# EAGLE design 4x2AND_OR_1 (EAGLE 6.5.0)

## Sheet 1 of 4
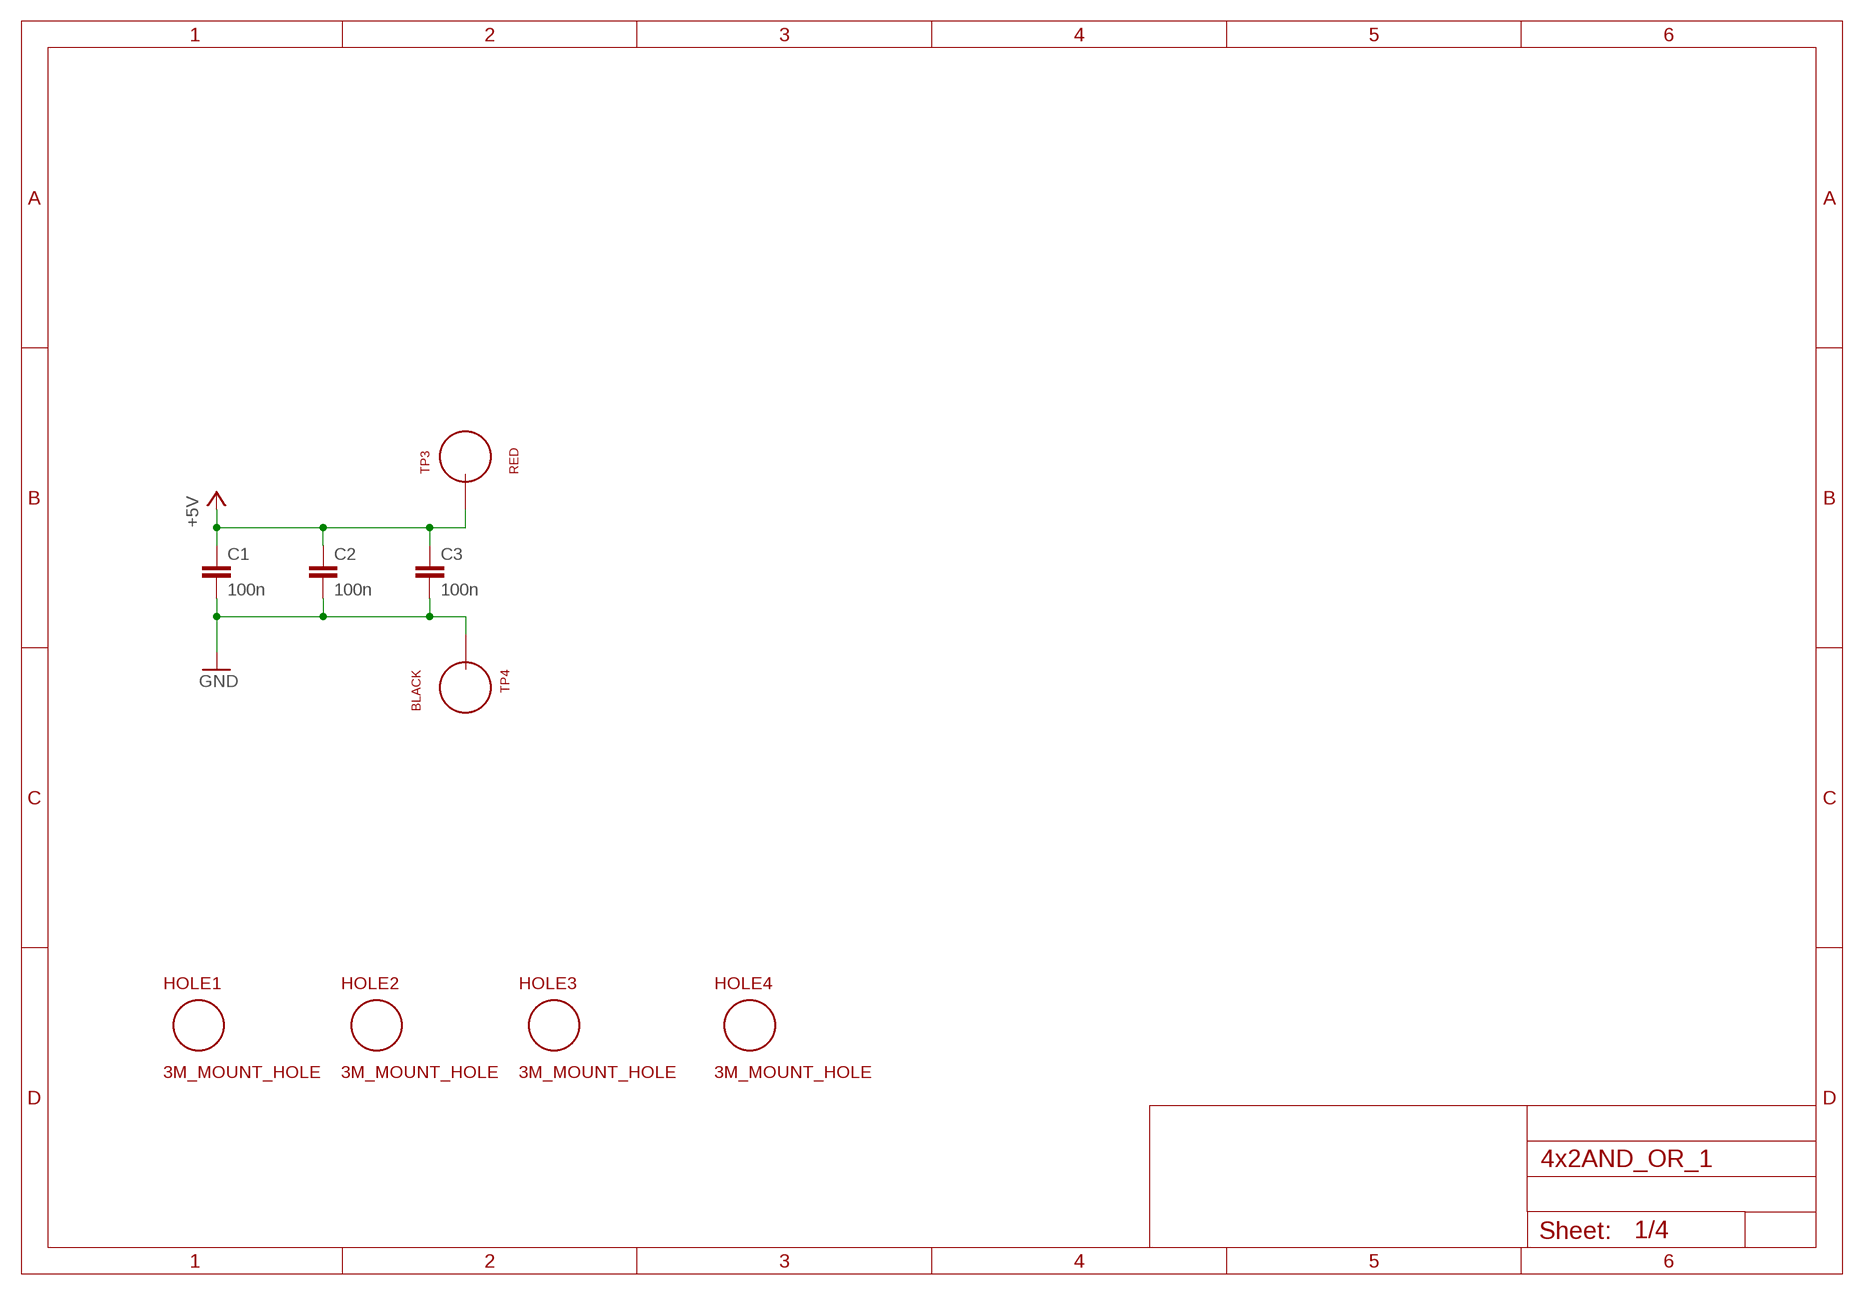
[diagram p0: schematic, sheet 1]

### Parts
C1  100n  C_P2INCH  [CAP_P2INCH]
C2  100n  C_P2INCH  [CAP_P2INCH]
C3  100n  C_P2INCH  [CAP_P2INCH]
HOLE1  3M_MOUNT_HOLE  [3M_HOLE]
HOLE2  3M_MOUNT_HOLE  [3M_HOLE]
HOLE3  3M_MOUNT_HOLE  [3M_HOLE]
HOLE4  3M_MOUNT_HOLE  [3M_HOLE]
TP3  RED  TEST_LOOP  [TEST_LOOP]
TP4  BLACK  TEST_LOOP  [TEST_LOOP]

### Nets
+5V: C1.1 C2.1 C3.1 TP3.P$1 ; also sheet 2,3,4
GND: C1.2 C2.2 C3.2 TP4.P$1 ; also sheet 2,3,4

## Sheet 2 of 4
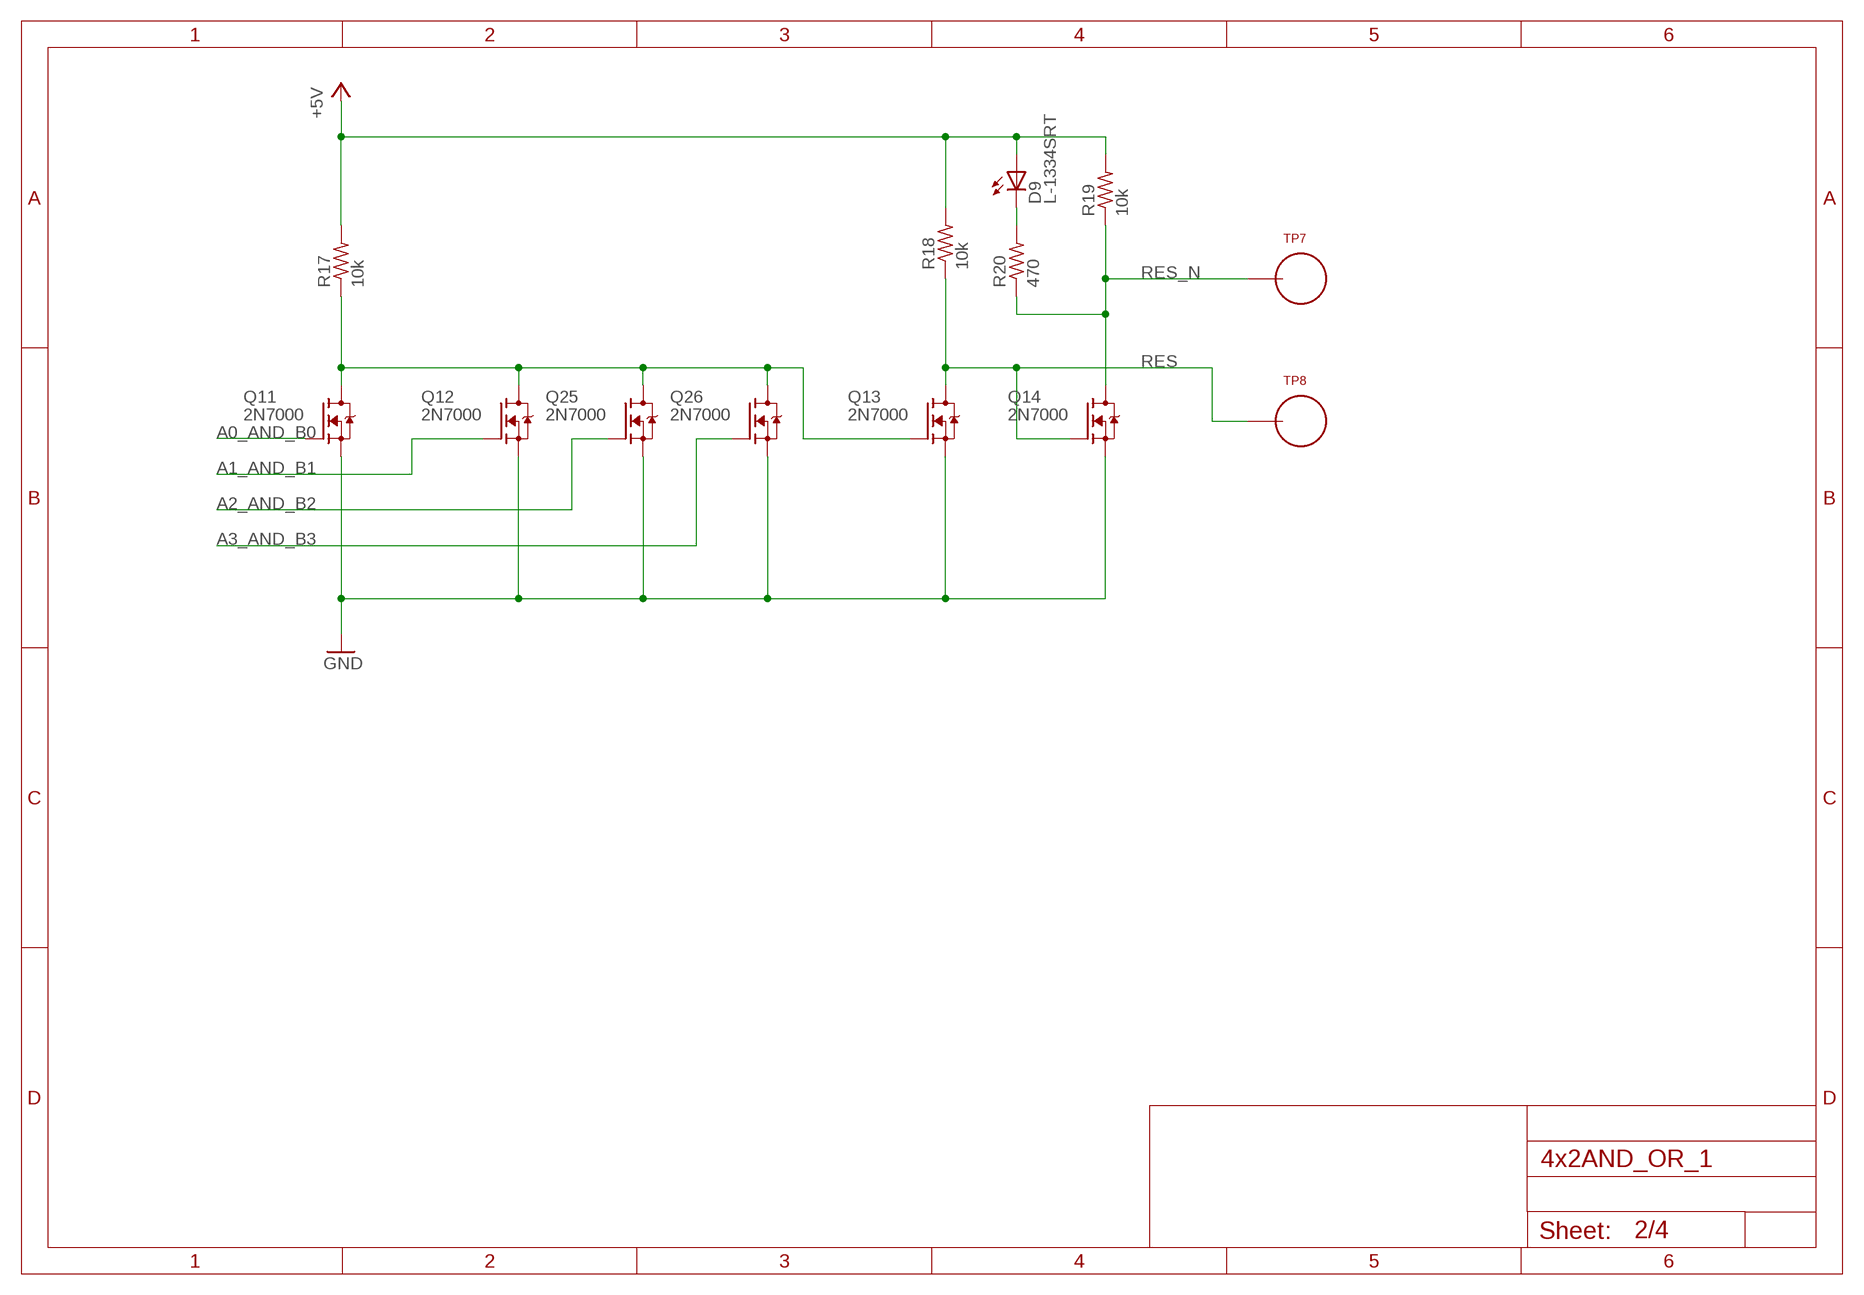
[diagram p1: schematic, sheet 2]

### Parts
D9  L-1334SRT  [LED3MM]
Q11  2N7000  [TO92-DGS]
Q12  2N7000  [TO92-DGS]
Q13  2N7000  [TO92-DGS]
Q14  2N7000  [TO92-DGS]
Q25  2N7000  [TO92-DGS]
Q26  2N7000  [TO92-DGS]
R17  10k  R_P2INCH  [R_P2INCH]
R18  10k  R_P2INCH  [R_P2INCH]
R19  10k  R_P2INCH  [R_P2INCH]
R20  470  R_P2INCH  [R_P2INCH]
TP7  TEST_LOOP  [TEST_LOOP]
TP8  TEST_LOOP  [TEST_LOOP]

### Nets
+5V: D9.A R17.2 R18.2 R19.2 ; also sheet 1,3,4
A0_AND_B0: Q11.G ; also sheet 3
A1_AND_B1: Q12.G ; also sheet 3
A2_AND_B2: Q25.G ; also sheet 4
A3_AND_B3: Q26.G ; also sheet 4
GND: Q11.S Q12.S Q13.S Q14.S Q25.S Q26.S ; also sheet 1,3,4
N$13: Q11.D Q12.D Q13.G Q25.D Q26.D R17.1
N$19: D9.K(C) R20.2
RES: Q13.D Q14.G R18.1 TP8.P$1
RES_N: Q14.D R19.1 R20.1 TP7.P$1

## Sheet 3 of 4
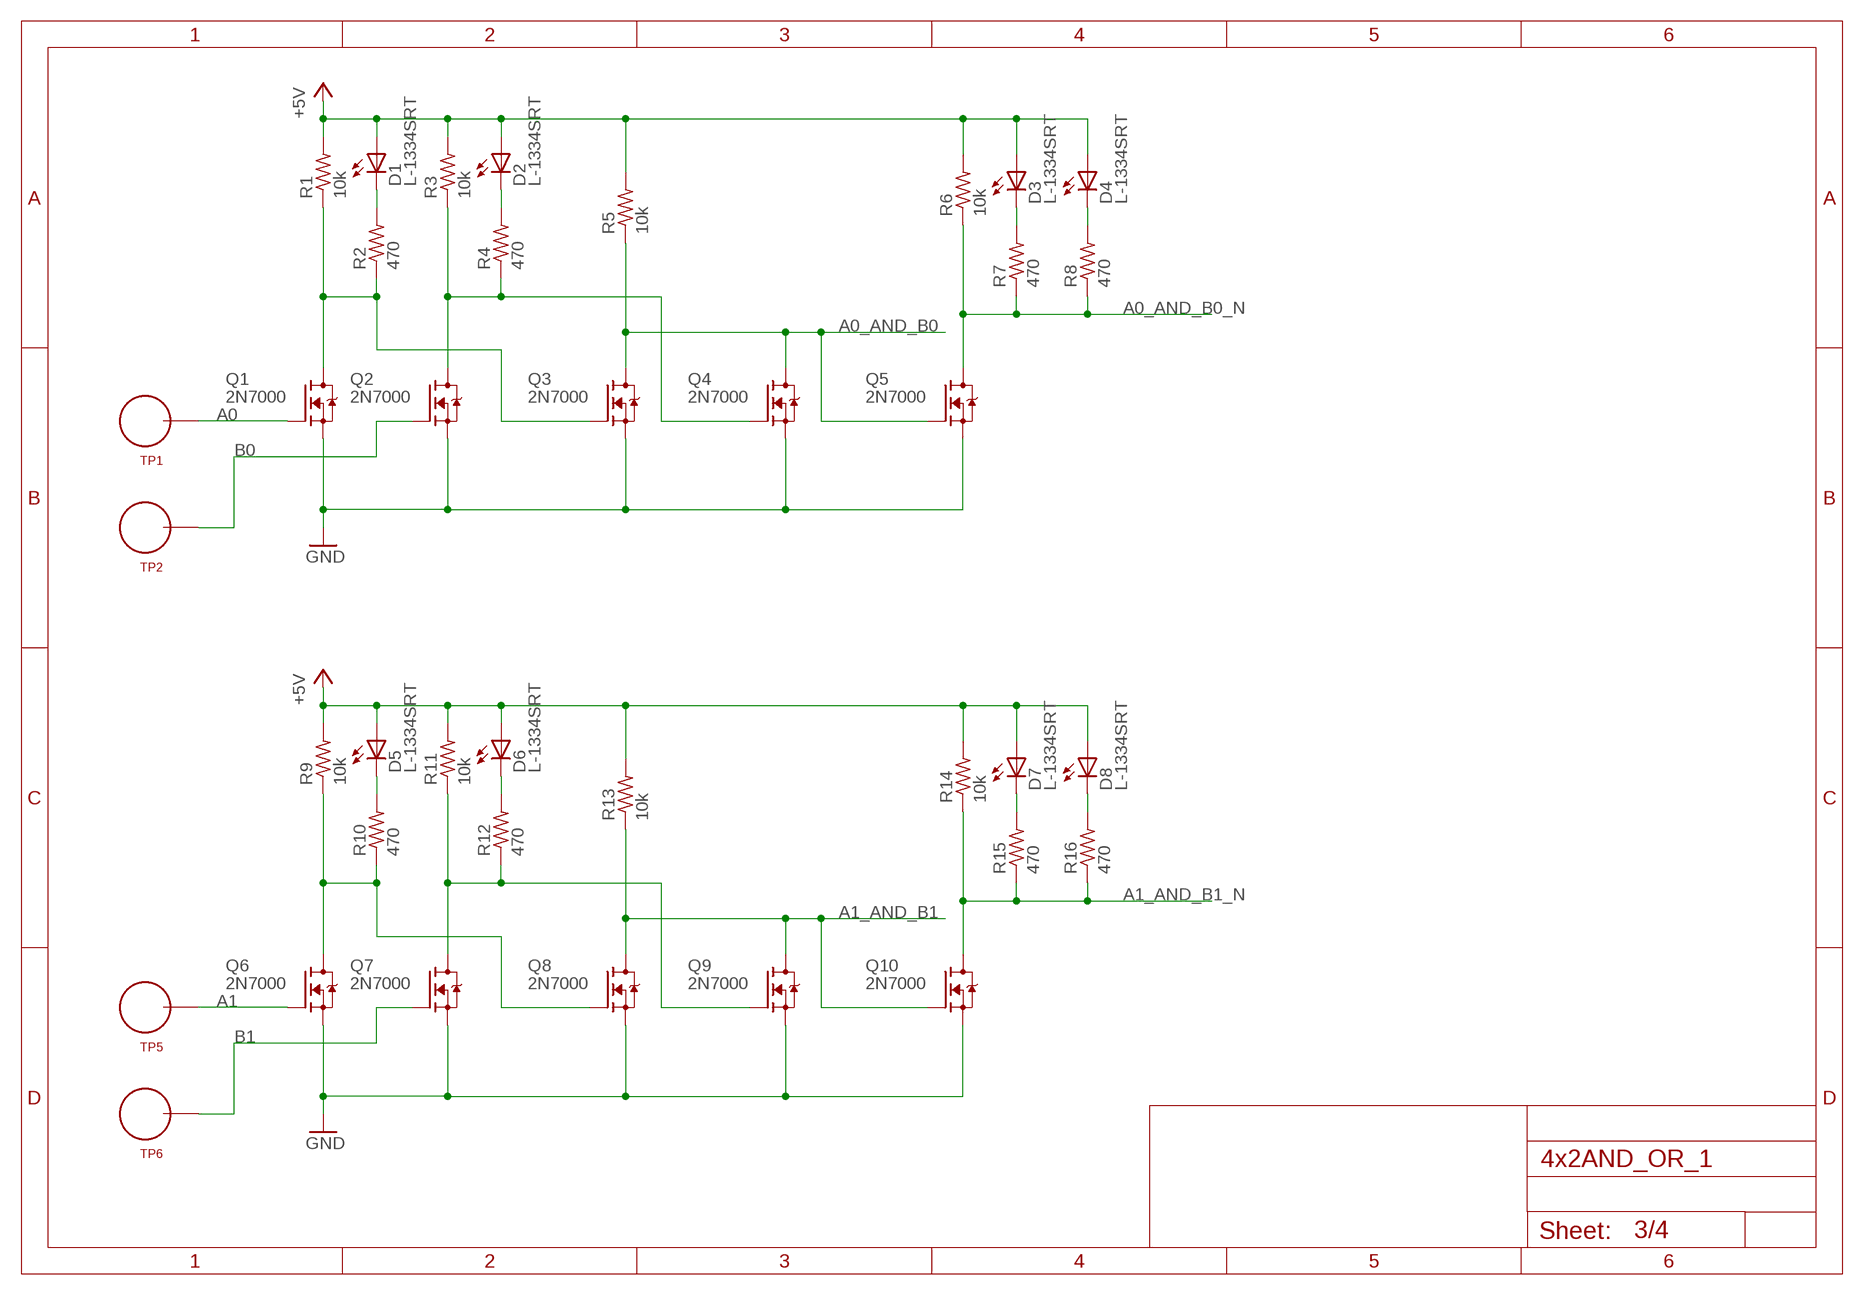
[diagram p2: schematic, sheet 3]

### Parts
D1  L-1334SRT  [LED3MM]
D2  L-1334SRT  [LED3MM]
D3  L-1334SRT  [LED3MM]
D4  L-1334SRT  [LED3MM]
D5  L-1334SRT  [LED3MM]
D6  L-1334SRT  [LED3MM]
D7  L-1334SRT  [LED3MM]
D8  L-1334SRT  [LED3MM]
Q1  2N7000  [TO92-DGS]
Q2  2N7000  [TO92-DGS]
Q3  2N7000  [TO92-DGS]
Q4  2N7000  [TO92-DGS]
Q5  2N7000  [TO92-DGS]
Q6  2N7000  [TO92-DGS]
Q7  2N7000  [TO92-DGS]
Q8  2N7000  [TO92-DGS]
Q9  2N7000  [TO92-DGS]
Q10  2N7000  [TO92-DGS]
R1  10k  R_P2INCH  [R_P2INCH]
R2  470  R_P2INCH  [R_P2INCH]
R3  10k  R_P2INCH  [R_P2INCH]
R4  470  R_P2INCH  [R_P2INCH]
R5  10k  R_P2INCH  [R_P2INCH]
R6  10k  R_P2INCH  [R_P2INCH]
R7  470  R_P2INCH  [R_P2INCH]
R8  470  R_P2INCH  [R_P2INCH]
R9  10k  R_P2INCH  [R_P2INCH]
R10  470  R_P2INCH  [R_P2INCH]
R11  10k  R_P2INCH  [R_P2INCH]
R12  470  R_P2INCH  [R_P2INCH]
R13  10k  R_P2INCH  [R_P2INCH]
R14  10k  R_P2INCH  [R_P2INCH]
R15  470  R_P2INCH  [R_P2INCH]
R16  470  R_P2INCH  [R_P2INCH]
TP1  TEST_LOOP  [TEST_LOOP]
TP2  TEST_LOOP  [TEST_LOOP]
TP5  TEST_LOOP  [TEST_LOOP]
TP6  TEST_LOOP  [TEST_LOOP]

### Nets
+5V: D1.A D2.A D3.A D4.A D5.A D6.A D7.A D8.A R1.2 R3.2 R5.2 R6.2 R9.2 R11.2 R13.2 R14.2 ; also sheet 1,2,4
A0: Q1.G TP1.P$1
A0_AND_B0: Q3.D Q4.D Q5.G R5.1 ; also sheet 2
A0_AND_B0_N: Q5.D R6.1 R7.1 R8.1
A1: Q6.G TP5.P$1
A1_AND_B1: Q8.D Q9.D Q10.G R13.1 ; also sheet 2
A1_AND_B1_N: Q10.D R14.1 R15.1 R16.1
B0: Q2.G TP2.P$1
B1: Q7.G TP6.P$1
GND: Q1.S Q2.S Q3.S Q4.S Q5.S Q6.S Q7.S Q8.S Q9.S Q10.S ; also sheet 1,2,4
N$1: D1.K(C) R2.2
N$2: Q1.D Q3.G R1.1 R2.1
N$3: D4.K(C) R8.2
N$4: D2.K(C) R4.2
N$5: Q2.D Q4.G R3.1 R4.1
N$6: D5.K(C) R10.2
N$7: Q6.D Q8.G R9.1 R10.1
N$8: D6.K(C) R12.2
N$9: D3.K(C) R7.2
N$10: Q7.D Q9.G R11.1 R12.1
N$11: D7.K(C) R15.2
N$12: D8.K(C) R16.2

## Sheet 4 of 4
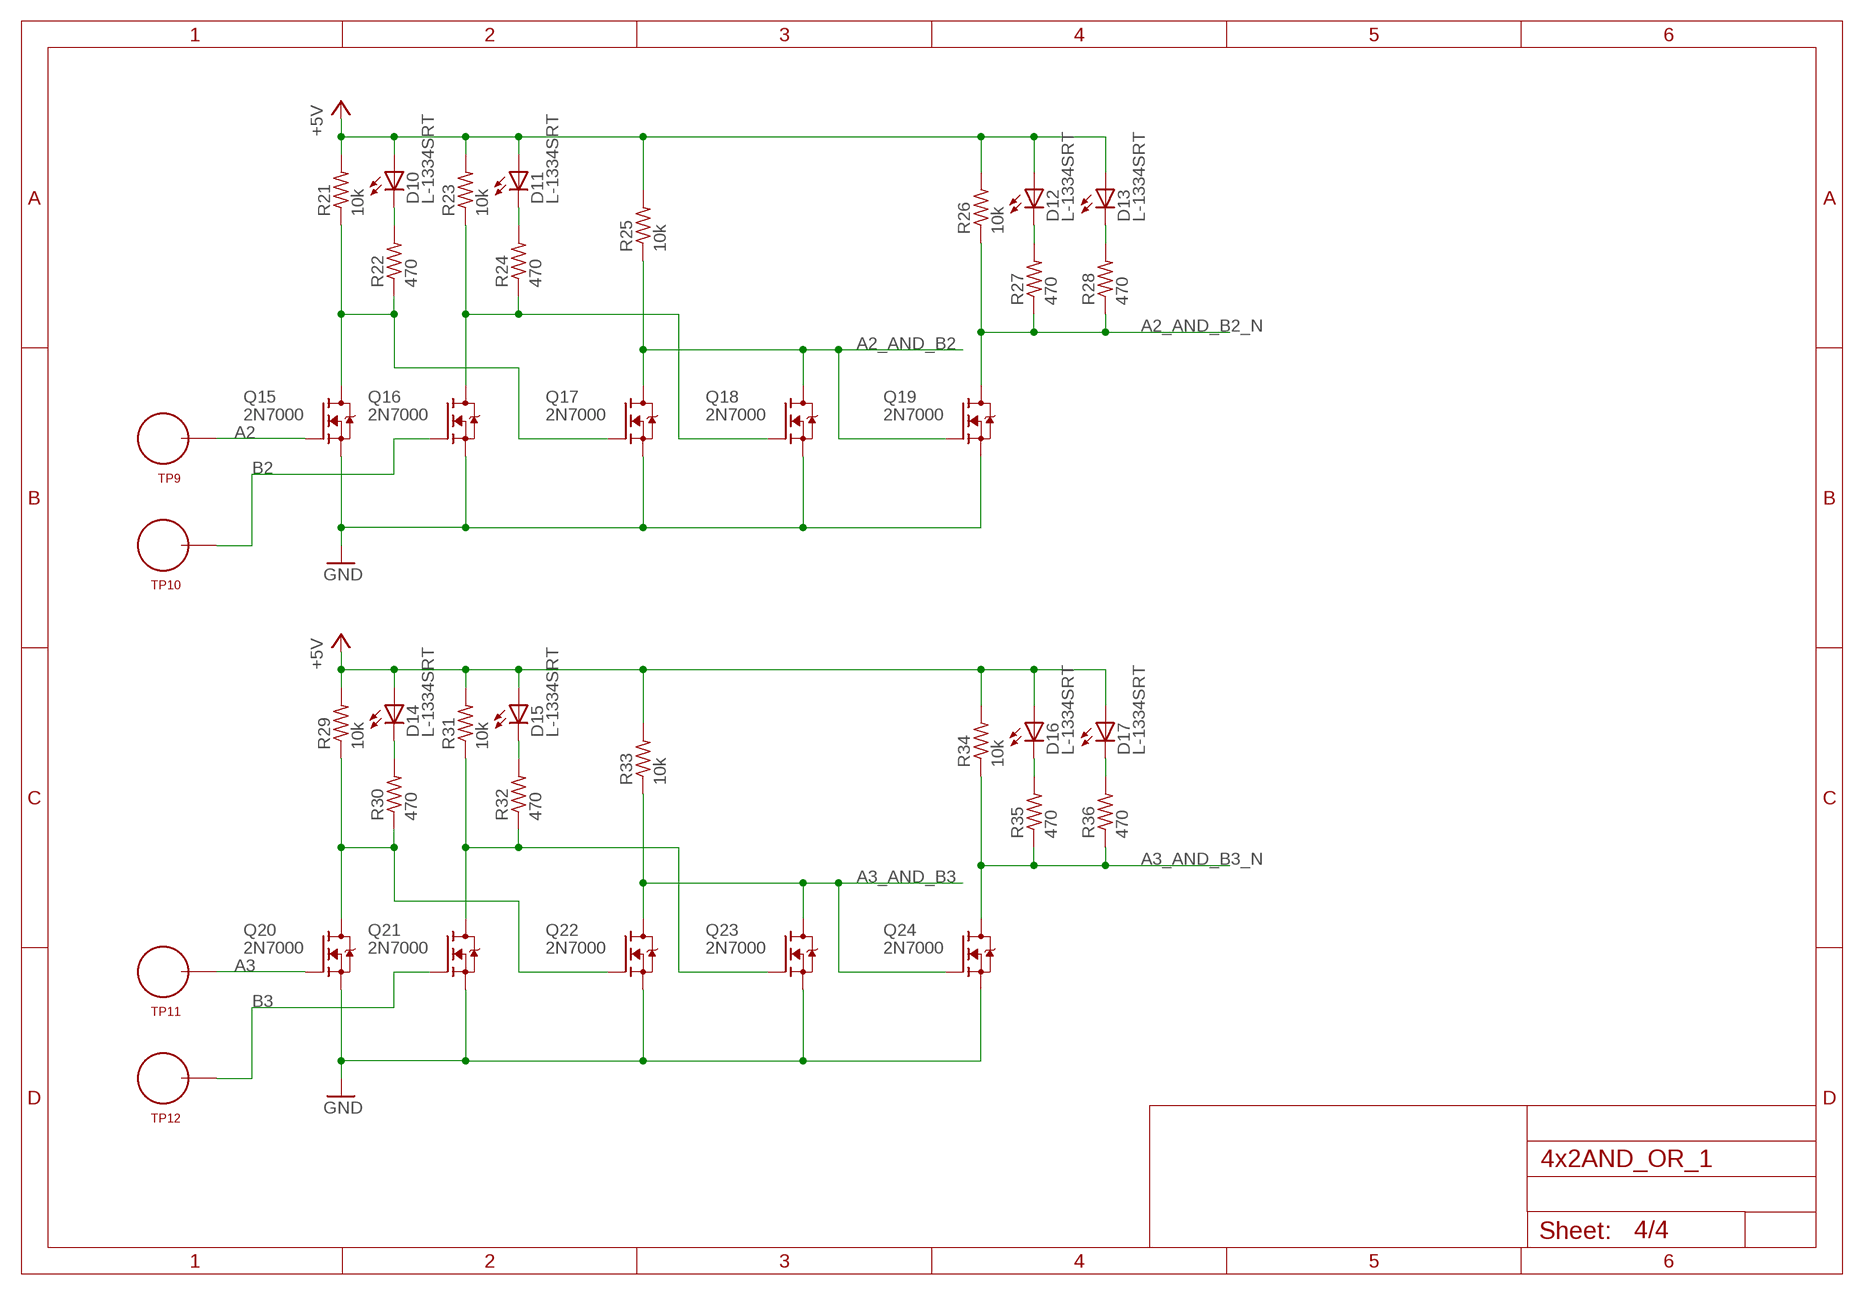
[diagram p3: schematic, sheet 4]

### Parts
D10  L-1334SRT  [LED3MM]
D11  L-1334SRT  [LED3MM]
D12  L-1334SRT  [LED3MM]
D13  L-1334SRT  [LED3MM]
D14  L-1334SRT  [LED3MM]
D15  L-1334SRT  [LED3MM]
D16  L-1334SRT  [LED3MM]
D17  L-1334SRT  [LED3MM]
Q15  2N7000  [TO92-DGS]
Q16  2N7000  [TO92-DGS]
Q17  2N7000  [TO92-DGS]
Q18  2N7000  [TO92-DGS]
Q19  2N7000  [TO92-DGS]
Q20  2N7000  [TO92-DGS]
Q21  2N7000  [TO92-DGS]
Q22  2N7000  [TO92-DGS]
Q23  2N7000  [TO92-DGS]
Q24  2N7000  [TO92-DGS]
R21  10k  R_P2INCH  [R_P2INCH]
R22  470  R_P2INCH  [R_P2INCH]
R23  10k  R_P2INCH  [R_P2INCH]
R24  470  R_P2INCH  [R_P2INCH]
R25  10k  R_P2INCH  [R_P2INCH]
R26  10k  R_P2INCH  [R_P2INCH]
R27  470  R_P2INCH  [R_P2INCH]
R28  470  R_P2INCH  [R_P2INCH]
R29  10k  R_P2INCH  [R_P2INCH]
R30  470  R_P2INCH  [R_P2INCH]
R31  10k  R_P2INCH  [R_P2INCH]
R32  470  R_P2INCH  [R_P2INCH]
R33  10k  R_P2INCH  [R_P2INCH]
R34  10k  R_P2INCH  [R_P2INCH]
R35  470  R_P2INCH  [R_P2INCH]
R36  470  R_P2INCH  [R_P2INCH]
TP9  TEST_LOOP  [TEST_LOOP]
TP10  TEST_LOOP  [TEST_LOOP]
TP11  TEST_LOOP  [TEST_LOOP]
TP12  TEST_LOOP  [TEST_LOOP]

### Nets
+5V: D10.A D11.A D12.A D13.A D14.A D15.A D16.A D17.A R21.2 R23.2 R25.2 R26.2 R29.2 R31.2 R33.2 R34.2 ; also sheet 1,2,3
A2: Q15.G TP9.P$1
A2_AND_B2: Q17.D Q18.D Q19.G R25.1 ; also sheet 2
A2_AND_B2_N: Q19.D R26.1 R27.1 R28.1
A3: Q20.G TP11.P$1
A3_AND_B3: Q22.D Q23.D Q24.G R33.1 ; also sheet 2
A3_AND_B3_N: Q24.D R34.1 R35.1 R36.1
B2: Q16.G TP10.P$1
B3: Q21.G TP12.P$1
GND: Q15.S Q16.S Q17.S Q18.S Q19.S Q20.S Q21.S Q22.S Q23.S Q24.S ; also sheet 1,2,3
N$14: D10.K(C) R22.2
N$15: Q15.D Q17.G R21.1 R22.1
N$16: D11.K(C) R24.2
N$17: Q16.D Q18.G R23.1 R24.1
N$18: D12.K(C) R27.2
N$20: D13.K(C) R28.2
N$21: D14.K(C) R30.2
N$22: Q20.D Q22.G R29.1 R30.1
N$23: D15.K(C) R32.2
N$24: Q21.D Q23.G R31.1 R32.1
N$25: D16.K(C) R35.2
N$26: D17.K(C) R36.2

## Library data of the parts
C1-C3 = MyLib:C_P2INCH
D1-D17 = MyLib:L-1334SRT
HOLE1-HOLE4 = MyLib:3M_MOUNT_HOLE
Q1-Q26 = MyLib:2N7000
R1-R36 = MyLib:R_P2INCH
TP1-TP12 = MyLib:TEST_LOOP

## Board
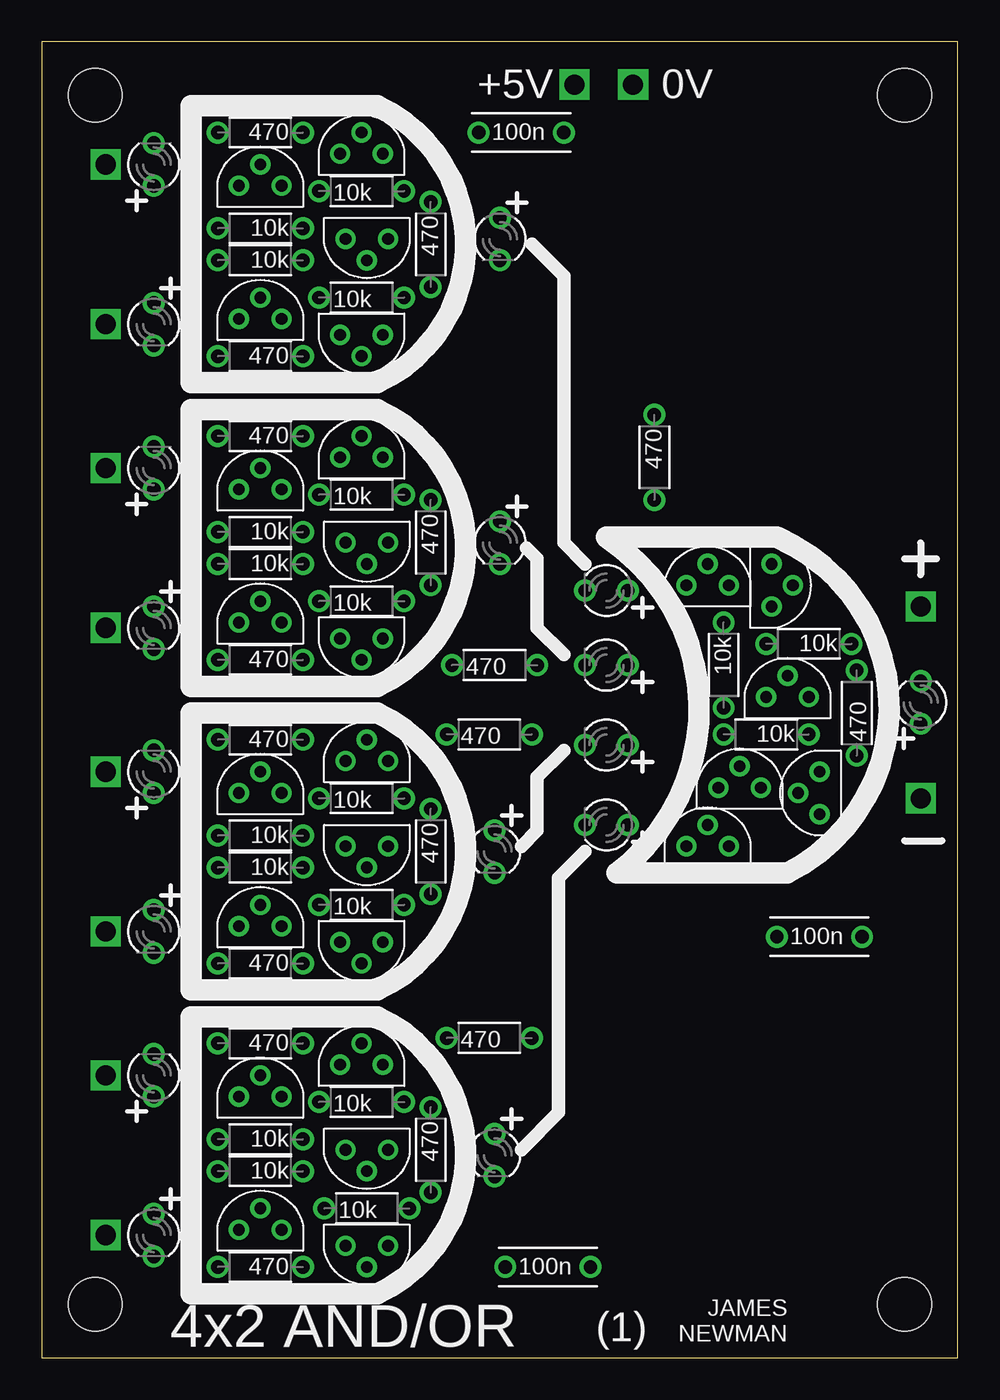
[diagram p4: board, top side]
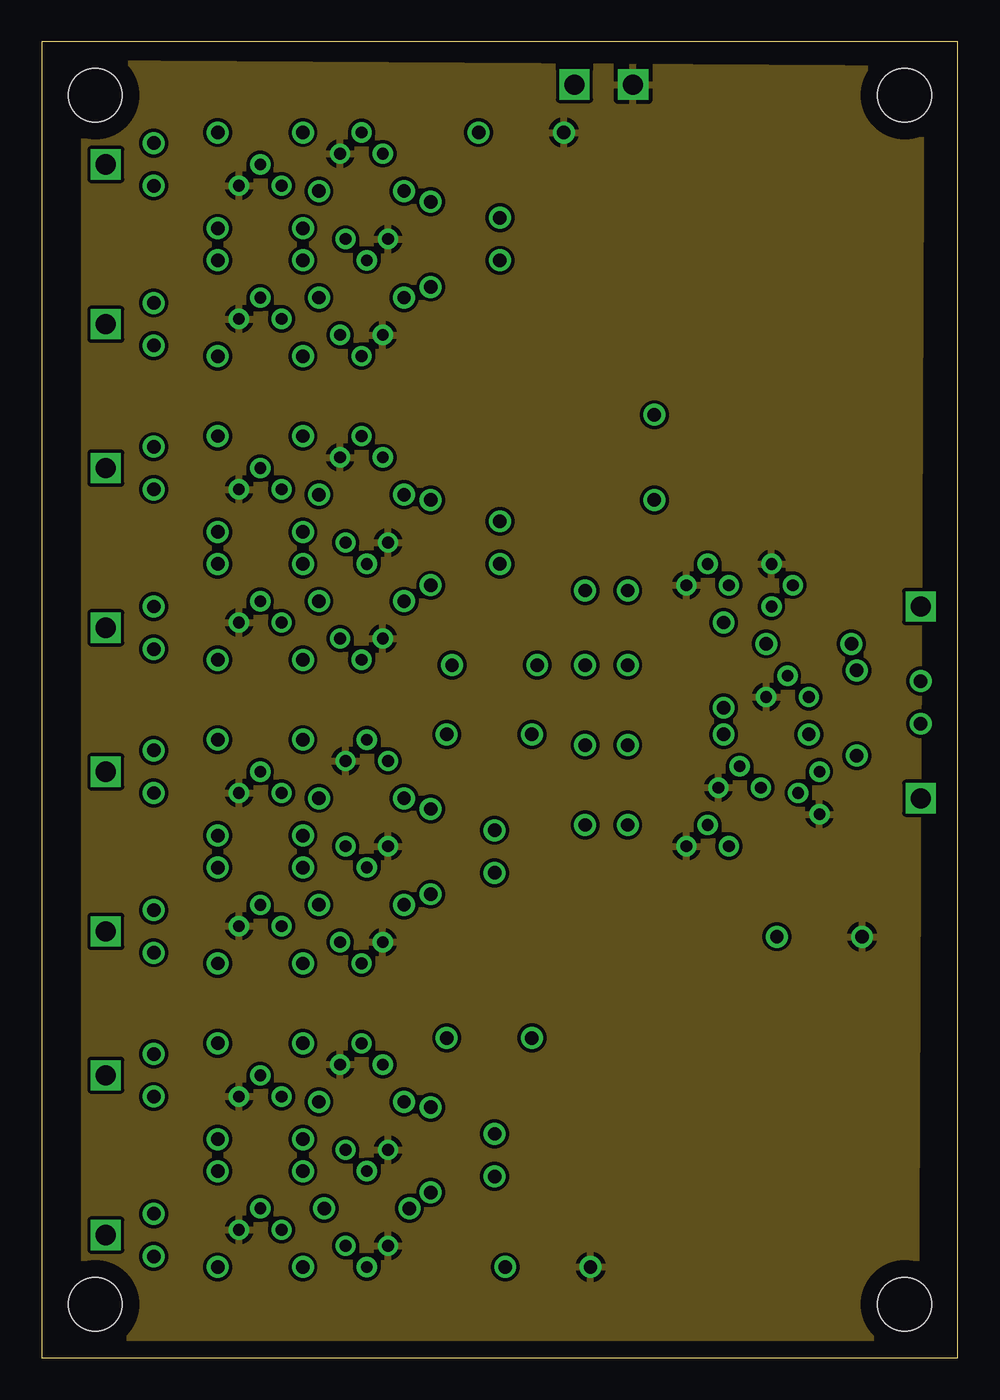
[diagram p5: board, inner layer Route2]
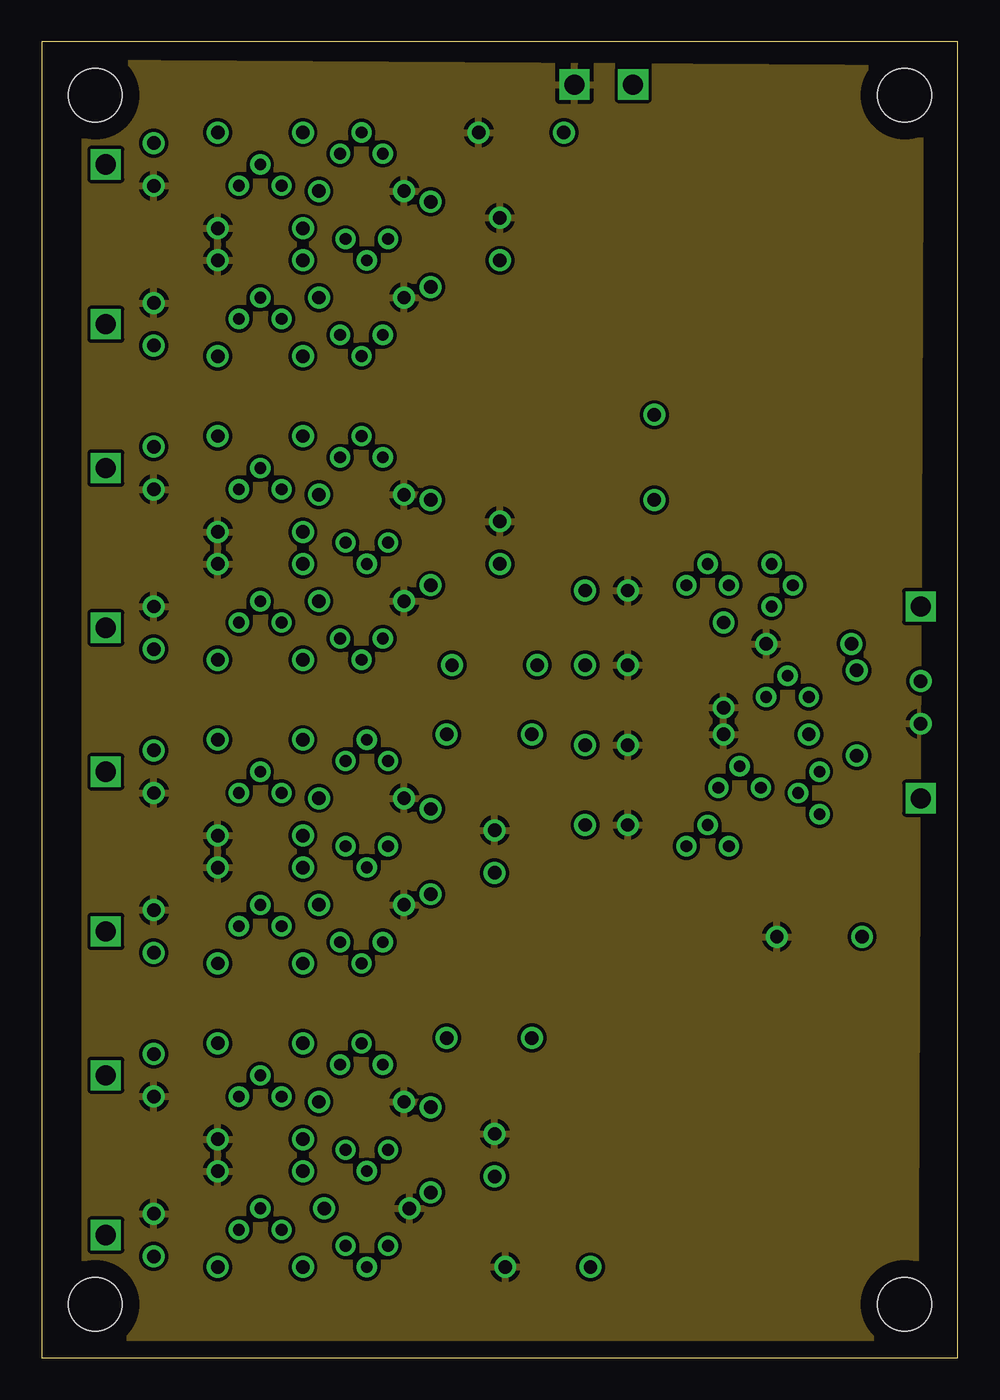
[diagram p6: board, inner layer Route3]
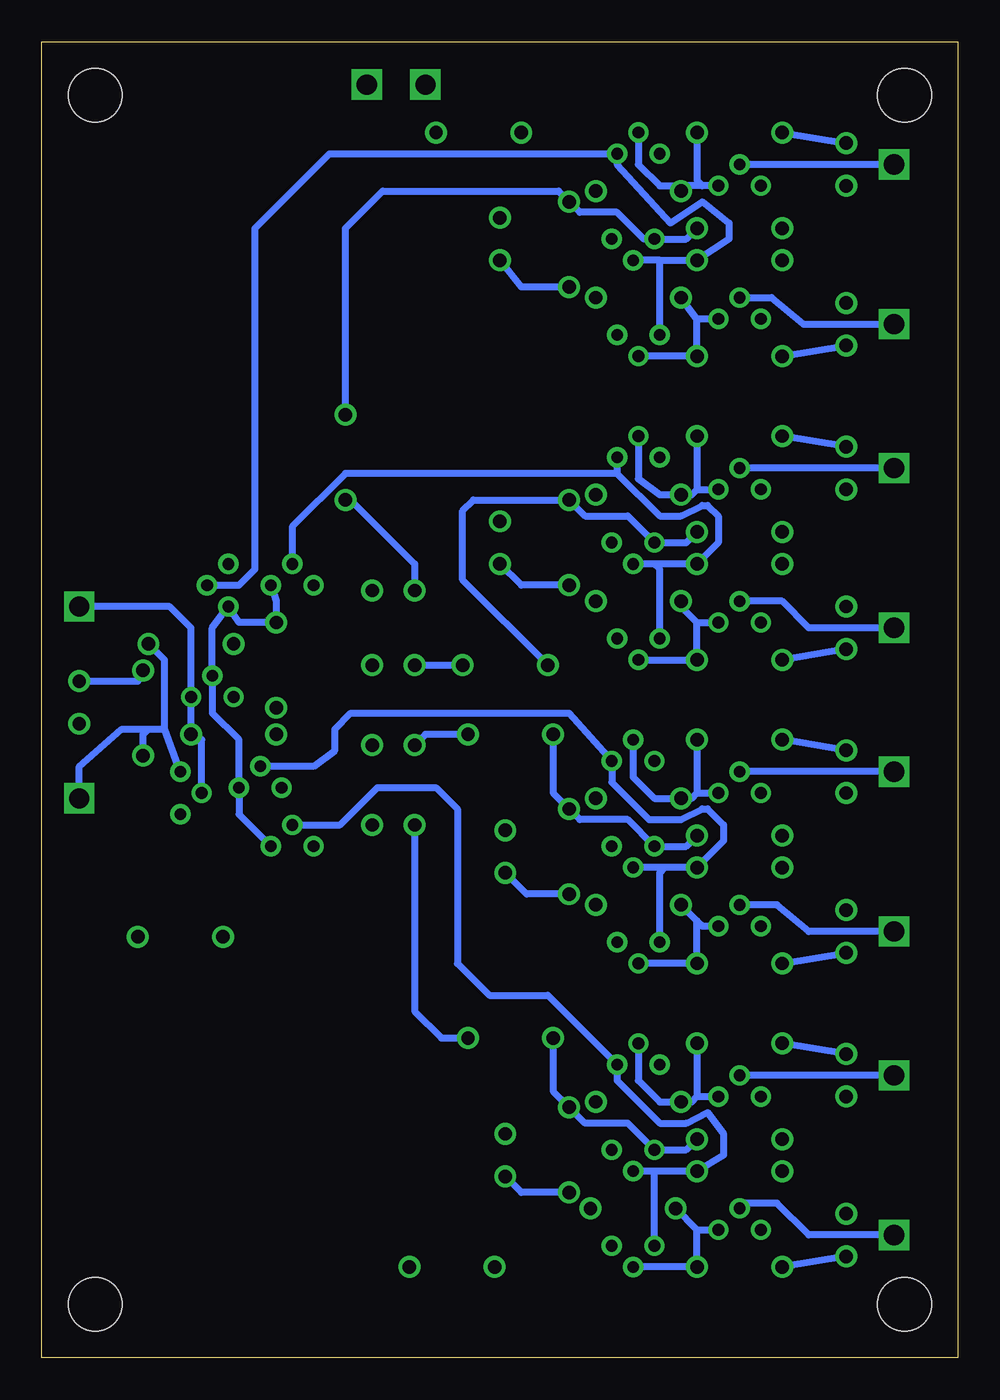
[diagram p7: board, bottom side, seen from below]

Size 54.61 x 78.42 mm. Coordinates in mm from the lower left corner, seen from the top.
Outline: 0,0 54.61,0 54.61,78.42 0,78.42 0,0
Copper layers (1*2+3*16): Top 0.035mm / dielectric 0.2mm / Route2 0.035mm / dielectric 1mm / Route3 0.035mm / dielectric 0.2mm / Bottom 0.035mm
Design rules "processor_rules_4layer": minimum track width 10mil, minimum drill 0.0236mm, track to track 8mil, track to pad 8mil, pad to pad 8mil, via to via 8mil, smd to smd 8mil, copper to edge 40mil, drill to drill 8mil, minimum pad ring 10mil, minimum via ring 8mil, stop-mask expansion 4mil, vias tented up to drill 0.7mm, thermal gap 10mil

### Footprints (pad centres in the part's own frame; a part is rotated, then mirrored left to right if it is on the bottom)
CAP_P2INCH = drill 0.8: 1 -2.54,0; 2 2.54,0
LED3MM = drill 0.8: A -1.27,0; K 1.27,0
3M_HOLE = hole 3.2: 0,0
TO92-DGS = drill 0.7: D 0,1.27; G -1.27,0; S 0,-1.27
R_P2INCH = drill 0.8: 1 -2.54,0; 2 2.54,0
TEST_LOOP = drill 1.2 square: P$1 0,0

### Placement (x,y rotation side)
C1  28.57,73.03 0 top
C2  46.35,25.08 0 top
C3  30.16,5.4 0 top
D1  6.67,71.12 90 top
D2  6.67,61.59 270 top
D3  27.3,66.67 270 top
D4  33.66,45.72 180 top
D5  6.67,53.02 90 top
D6  6.67,43.5 270 top
D7  27.3,48.58 270 top
D8  33.66,41.27 180 top
D9  52.39,39.05 90 top
D10  6.67,34.92 90 top
D11  6.67,25.4 270 top
D12  26.99,30.16 270 top
D13  33.66,36.51 180 top
D14  6.67,16.83 90 top
D15  6.67,7.3 270 top
D16  26.99,12.06 270 top
D17  33.66,31.75 180 top
HOLE1  3.17,3.17 0 top
HOLE2  51.44,3.17 0 top
HOLE3  3.17,75.25 0 top
HOLE4  51.44,75.25 0 top
Q1  13.02,69.85 270 top
Q2  13.02,61.91 270 top
Q3  19.05,71.75 270 top
Q4  19.05,60.96 90 top
Q5  19.37,66.67 90 top
Q6  13.02,51.75 270 top
Q7  13.02,43.81 270 top
Q8  19.05,53.66 270 top
Q9  19.05,42.86 90 top
Q10  19.37,48.58 90 top
Q11  43.5,46.04 180 top
Q12  39.69,46.04 270 top
Q13  44.45,39.37 270 top
Q14  46.35,33.66 0 top
Q15  13.02,33.66 270 top
Q16  13.02,25.72 270 top
Q17  19.37,35.56 270 top
Q18  19.05,24.77 90 top
Q19  19.37,30.48 90 top
Q20  13.02,15.56 270 top
Q21  13.02,7.62 270 top
Q22  19.05,17.46 270 top
Q23  19.37,6.67 90 top
Q24  19.37,12.38 90 top
Q25  41.59,33.97 270 top
Q26  39.69,30.48 270 top
R1  19.05,69.53 0 top
R2  13.02,73.03 180 top
R3  19.05,63.18 0 top
R4  13.02,59.69 180 top
R5  13.02,65.41 180 top
R6  13.02,67.31 180 top
R7  23.18,66.36 270 top
R8  36.51,53.66 270 top
R9  19.05,51.44 0 top
R10  13.02,54.93 180 top
R11  19.05,45.09 0 top
R12  13.02,41.59 180 top
R13  13.02,47.31 180 top
R14  13.02,49.21 180 top
R15  23.18,48.58 270 top
R16  26.99,41.27 0 top
R17  40.64,41.27 270 top
R18  43.18,37.15 180 top
R19  45.72,42.55 180 top
R20  48.58,38.42 90 top
R21  19.05,33.34 0 top
R22  13.02,36.83 180 top
R23  19.05,26.99 0 top
R24  13.02,23.5 180 top
R25  13.02,29.21 180 top
R26  13.02,31.11 180 top
R27  23.18,30.16 270 top
R28  26.67,37.15 0 top
R29  19.05,15.24 0 top
R30  13.02,18.73 180 top
R31  19.37,8.89 0 top
R32  13.02,5.4 180 top
R33  13.02,11.11 180 top
R34  13.02,13.02 180 top
R35  23.18,12.38 270 top
R36  26.67,19.05 0 top
TP1  3.81,71.12 0 top
TP2  3.81,61.59 0 top
TP3  31.75,75.88 0 top
TP4  35.24,75.88 0 top
TP5  3.81,53.02 0 top
TP6  3.81,43.5 0 top
TP7  52.39,33.34 0 top
TP8  52.39,44.77 0 top
TP9  3.81,34.92 0 top
TP10  3.81,25.4 0 top
TP11  3.81,16.83 0 top
TP12  3.81,7.3 0 top

### Tracks (layer width: path | path; a pad name or v marks a point on that pad's centre or on a via)
+5V
  pour Route3: 2.54,77.15 2.54,0.95 52.07,0.95 52.39,76.83
A0
  Bottom 0.406: TP1.P$1 Q1.G
A0_AND_B0
  Bottom 0.406: Q4.D 17.78,65.41 | 17.78,65.41 Q5.G | 17.78,65.41 R5.1 13.65,66.67 13.65,67.63 15.24,68.9 17.14,67.63 20.32,71.12 Q3.D 37.47,71.75 41.91,67.31 41.91,46.99 42.86,46.04 Q11.G
A0_AND_B0_N
  Bottom 0.406: R6.1 16.19,66.67 Q5.D 18.73,66.67 20.32,68.26 22.54,68.26 R7.1 23.81,69.53 34.29,69.53 36.51,67.31 R8.1
A1
  Bottom 0.406: TP5.P$1 Q6.G
A1_AND_B1
  Bottom 0.406: 18.1,47.31 R13.1 14.29,48.58 14.29,50.16 14.92,50.8 15.24,50.8 16.51,50.16 17.78,50.16 20.32,52.7 | 18.1,47.31 Q10.G | Q9.D 17.78,46.99 18.1,47.31 | Q8.D 20.32,52.7 | 20.32,52.7 36.51,52.7 39.69,49.53 Q12.G
A1_AND_B1_N
  Bottom 0.406: R14.1 16.19,48.58 Q10.D 19.68,50.16 22.23,50.16 R15.1 28.89,51.12 29.53,50.48 29.53,46.35 R16.1
A2
  Bottom 0.406: TP9.P$1 Q15.G
A2_AND_B2
  Bottom 0.406: 17.46,29.21 R25.1 13.97,30.8 13.97,31.75 14.92,32.7 15.24,32.7 16.51,32.07 18.41,32.07 20.64,34.29 Q17.D 23.18,38.42 36.2,38.42 37.15,37.47 37.15,36.2 38.42,35.24 Q25.G | 17.46,29.21 Q19.G | Q18.D 17.78,28.89 17.46,29.21
A2_AND_B2_N
  Bottom 0.406: R26.1 16.19,30.48 Q19.D 19.68,32.07 22.54,32.07 R27.1 24.13,33.66 R28.1
A3
  Bottom 0.406: TP11.P$1 Q20.G
A3_AND_B3
  Bottom 0.406: 18.1,11.11 R33.1 13.97,12.06 13.97,13.34 14.92,14.61 16.19,13.97 17.78,13.97 20.32,16.51 Q22.D 24.45,21.59 27.94,21.59 29.84,23.5 29.84,32.7 31.11,33.97 34.61,33.97 36.83,31.75 Q26.G | 18.1,11.11 Q24.G | Q23.D 18.1,11.11
A3_AND_B3_N
  Bottom 0.406: R34.1 16.19,12.38 Q24.D 19.68,13.97 22.23,13.97 R35.1 24.13,15.88 R36.1
B0
  Bottom 0.406: Q2.G 11.11,63.18 9.21,61.59 TP2.P$1
B1
  Bottom 0.406: TP6.P$1 8.89,43.5 10.48,45.09 Q7.G
B2
  Bottom 0.406: TP10.P$1 8.89,25.4 10.79,26.99 Q16.G
B3
  Bottom 0.406: TP12.P$1 8.89,7.3 10.79,9.21 12.7,9.21 Q21.G
GND
  pour Route2: 2.54,77.15 52.39,76.83 52.07,0.95 2.54,0.95
N$1
  Bottom 0.406: R2.2 D1.K
N$2
  Bottom 0.406: Q3.G 19.05,71.12 17.78,69.85 16.83,69.85 R1.1 16.19,69.85 15.24,69.85 | Q1.D 15.24,69.85 | R2.1 15.56,70.17 15.24,69.85
N$3
  Bottom 0.406: R8.2 36.2,51.12 32.38,47.31 D4.K
N$4
  Bottom 0.406: R4.2 D2.K
N$5
  Bottom 0.406: Q2.D 15.56,61.91 | 15.56,61.91 R3.1 | 15.56,61.91 R4.1 Q4.G
N$6
  Bottom 0.406: D5.K R10.2
N$7
  Bottom 0.406: R10.1 15.56,51.75 | 15.56,51.75 Q6.D | 15.56,51.75 15.88,51.44 R9.1 17.78,51.44 19.05,52.39 Q8.G
N$8
  Bottom 0.406: D6.K R12.2
N$9
  Bottom 0.406: R7.2 26.04,63.82 D3.K
N$10
  Bottom 0.406: Q9.G R12.1 15.56,43.81 | 15.56,43.81 Q7.D | R11.1 16.51,44.77 15.56,43.81
N$11
  Bottom 0.406: R15.2 26.04,46.04 D7.K
N$12
  Bottom 0.406: D8.K R16.2
N$13
  Bottom 0.406: Q12.D 40.64,45.09 R17.1 42.86,43.81 Q11.D 44.45,43.5 Q13.G 44.45,38.42 42.86,36.83 Q25.D 42.86,32.38 Q26.D
N$14
  Bottom 0.406: D10.K R22.2
N$15
  Bottom 0.406: R22.1 15.56,33.66 | 15.56,33.66 Q15.D | 15.56,33.66 15.88,33.34 R21.1 18.1,33.34 19.37,34.61 Q17.G
N$16
  Bottom 0.406: R24.2 D11.K
N$17
  Bottom 0.406: 15.56,26.04 R24.1 Q18.G | 15.56,26.04 R23.1 | 15.56,26.04 15.24,25.72 Q16.D
N$18
  Bottom 0.406: R27.2 25.72,27.62 D12.K
N$19
  Bottom 0.406: D9.K 48.9,40.32 R20.2
N$20
  Bottom 0.406: R28.2 31.75,37.15 D13.K
N$21
  Bottom 0.406: D14.K R30.2
N$22
  Bottom 0.406: R30.1 15.56,15.56 | 15.56,15.56 Q20.D | 15.56,15.56 15.88,15.24 R29.1 17.78,15.24 19.05,16.51 Q22.G
N$23
  Bottom 0.406: D15.K R32.2
N$24
  Bottom 0.406: Q23.G R32.1 15.56,7.62 | 15.56,7.62 R31.1 | 15.56,7.62 Q21.D
N$25
  Bottom 0.406: R35.2 26.04,9.84 D16.K
N$26
  Bottom 0.406: D17.K 32.38,20.64 30.8,19.05 R36.2
RES
  Bottom 0.406: Q14.G 45.09,36.83 R18.1 Q13.D 45.72,43.5 46.99,44.77 TP8.P$1
RES_N
  Bottom 0.406: Q14.D 47.31,37.47 | 47.31,37.47 47.31,41.59 R19.1 | TP7.P$1 52.39,35.24 49.85,37.47 48.26,37.47 | 48.26,37.47 47.31,37.47 | R20.1 48.58,37.15 48.26,37.47

### Text on the board
tPlace: +5V | 0V | JAMES / NEWMAN | 4x2 AND/OR | (1)